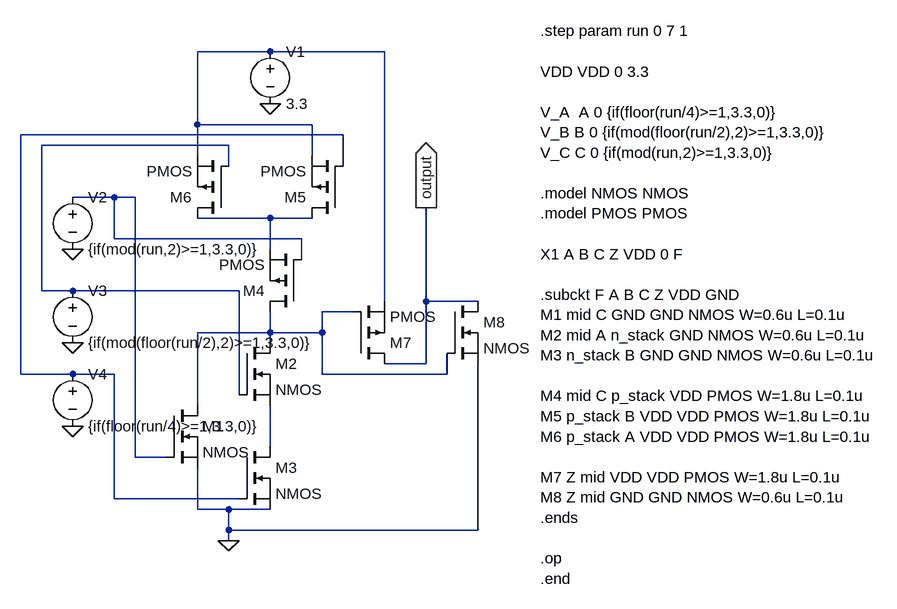
[diagram p0: schematic CMOS logic-gate design.asc]
CMOS logic-gate design.asc, the LTspice schematic file:
Version 4.1
SHEET 1 1544 680
WIRE 320 -544 208 -544
WIRE 496 -544 320 -544
WIRE 208 -432 208 -544
WIRE 384 -432 208 -432
WIRE 432 -416 -64 -416
WIRE 256 -400 -32 -400
WIRE 208 -384 208 -432
WIRE 384 -384 384 -432
WIRE 256 -368 256 -400
WIRE 432 -368 432 -416
WIRE 80 -320 16 -320
WIRE 112 -320 80 -320
WIRE 320 -288 208 -288
WIRE 384 -288 320 -288
WIRE 80 -256 80 -320
WIRE 368 -256 80 -256
WIRE 320 -240 320 -288
WIRE 368 -224 368 -256
WIRE -32 -176 -32 -400
WIRE 16 -176 -32 -176
WIRE 272 -176 16 -176
WIRE 496 -160 496 -544
WIRE 560 -160 560 -304
WIRE 640 -160 560 -160
WIRE 448 -144 400 -144
WIRE 320 -112 320 -144
WIRE 320 -112 208 -112
WIRE 400 -112 400 -144
WIRE 400 -112 320 -112
WIRE 320 -96 320 -112
WIRE 560 -64 560 -160
WIRE 560 -64 496 -64
WIRE -64 -48 -64 -416
WIRE 16 -48 -64 -48
WIRE 80 -48 16 -48
WIRE 400 -48 400 -112
WIRE 592 -48 592 -80
WIRE 592 -48 400 -48
WIRE 272 -16 272 -176
WIRE 208 0 208 -112
WIRE 320 64 320 0
WIRE 112 80 112 -320
WIRE 160 80 112 80
WIRE 80 144 80 -48
WIRE 272 144 80 144
WIRE 208 160 208 96
WIRE 256 160 208 160
WIRE 320 160 256 160
WIRE 256 192 256 160
WIRE 640 192 640 -64
WIRE 640 192 256 192
WIRE 256 208 256 192
FLAG 16 -240 0
FLAG 16 -96 0
FLAG 16 32 0
FLAG 320 -464 0
FLAG 256 208 0
FLAG 560 -304 output
IOPIN 560 -304 Out
SYMBOL voltage 16 -336 R0
WINDOW 123 0 0 Left 0
WINDOW 39 0 0 Left 0
SYMATTR InstName V2
SYMATTR Value {if(mod(run,2)>=1,3.3,0)}
SYMBOL voltage 16 -192 R0
SYMATTR InstName V3
SYMATTR Value {if(mod(floor(run/2),2)>=1,3.3,0)}
SYMBOL voltage 16 -64 R0
SYMATTR InstName V4
SYMATTR Value {if(floor(run/4)>=1,3.3,0)}
SYMBOL nmos 160 0 R0
SYMATTR InstName M1
SYMBOL nmos 272 -96 R0
SYMATTR InstName M2
SYMBOL nmos 272 64 R0
SYMATTR InstName M3
SYMBOL pmos 368 -144 R180
SYMATTR InstName M4
SYMBOL pmos 256 -288 R180
SYMATTR InstName M6
SYMBOL pmos 432 -288 R180
SYMATTR InstName M5
SYMBOL voltage 320 -560 R0
SYMATTR InstName V1
SYMATTR Value 3.3
SYMBOL pmos 448 -64 M180
SYMATTR InstName M7
SYMBOL nmos 592 -160 R0
SYMATTR InstName M8
TEXT 736 -576 Left 2 !.step param run 0 7 1\n \nVDD VDD 0 3.3\n \nV_A  A 0 {if(floor(run/4)>=1,3.3,0)}\nV_B B 0 {if(mod(floor(run/2),2)>=1,3.3,0)}\nV_C C 0 {if(mod(run,2)>=1,3.3,0)}\n \n.model NMOS NMOS\n.model PMOS PMOS\n \nX1 A B C Z VDD 0 F\n \n.subckt F A B C Z VDD GND\nM1 mid C GND GND NMOS W=0.6u L=0.1u\nM2 mid A n_stack GND NMOS W=0.6u L=0.1u\nM3 n_stack B GND GND NMOS W=0.6u L=0.1u\n \nM4 mid C p_stack VDD PMOS W=1.8u L=0.1u\nM5 p_stack B VDD VDD PMOS W=1.8u L=0.1u\nM6 p_stack A VDD VDD PMOS W=1.8u L=0.1u\n \nM7 Z mid VDD VDD PMOS W=1.8u L=0.1u\nM8 Z mid GND GND NMOS W=0.6u L=0.1u\n.ends\n \n.op\n.end

The netlist it stands for:
* CMOS logic-gate design.asc
V2 N004 0 {if(mod(run,2)>=1,3.3,0)}
V3 N003 0 {if(mod(floor(run/2),2)>=1,3.3,0)}
V4 N002 0 {if(floor(run/4)>=1,3.3,0)}
M1 N006 N004 0 0 NMOS
M2 N006 N003 N007 N007 NMOS
M3 N007 N002 0 0 NMOS
M4 N006 N004 N005 N005 PMOS
M6 N005 N003 N001 N001 PMOS
M5 N005 N002 N001 N001 PMOS
V1 N001 0 3.3
M7 output N006 N001 N001 PMOS
M8 output N006 0 0 NMOS
.model NMOS NMOS
.model PMOS PMOS
.lib standard.mos
.step param run 0 7 1
VDD VDD 0 3.3
V_A  A 0 {if(floor(run/4)>=1,3.3,0)}
V_B B 0 {if(mod(floor(run/2),2)>=1,3.3,0)}
V_C C 0 {if(mod(run,2)>=1,3.3,0)}
.model NMOS NMOS
.model PMOS PMOS
X1 A B C Z VDD 0 F
.subckt F A B C Z VDD GND
M1 mid C GND GND NMOS W=0.6u L=0.1u
M2 mid A n_stack GND NMOS W=0.6u L=0.1u
M3 n_stack B GND GND NMOS W=0.6u L=0.1u
M4 mid C p_stack VDD PMOS W=1.8u L=0.1u
M5 p_stack B VDD VDD PMOS W=1.8u L=0.1u
M6 p_stack A VDD VDD PMOS W=1.8u L=0.1u
M7 Z mid VDD VDD PMOS W=1.8u L=0.1u
M8 Z mid GND GND NMOS W=0.6u L=0.1u
.ends
.op
.end
.backanno
.end